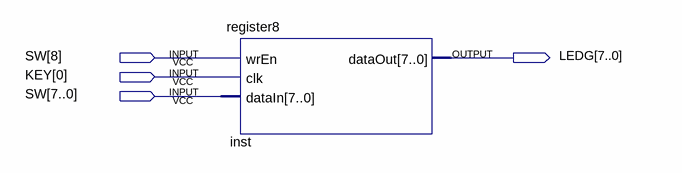
[diagram p0: schematic sheet]
// Quartus schematic Register_Demo.bdf as structural Verilog: 1 symbols, 4 pins
module Register_Demo (
  input  [8:0] SW,
  input  [0:0] KEY,
  output [7:0] LEDG
);

  register8 inst (.wrEn(SW[8]), .clk(KEY[0]), .dataIn(SW[7:0]), .dataOut(LEDG));
endmodule
